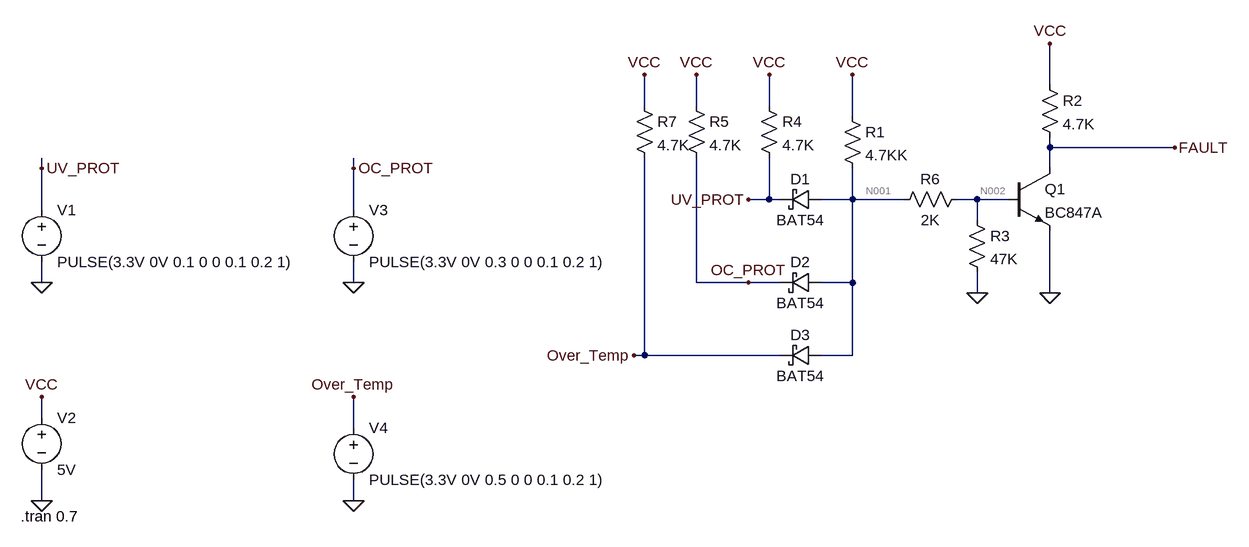
[diagram p0: schematic FaultOR.asc]
FaultOR.asc, the LTspice schematic file:
Version 4
SHEET 1 1984 864
WIRE 1504 -240 1504 -304
WIRE 880 -208 880 -256
WIRE 960 -208 960 -256
WIRE 1072 -208 1072 -256
WIRE 1200 -192 1200 -256
WIRE 1504 -144 1504 -160
WIRE 1696 -144 1504 -144
WIRE -48 -112 -48 -128
WIRE 432 -112 432 -128
WIRE 1504 -112 1504 -144
WIRE 1072 -64 1072 -128
WIRE 1072 -64 1040 -64
WIRE 1088 -64 1072 -64
WIRE 1200 -64 1200 -112
WIRE 1200 -64 1152 -64
WIRE 1280 -64 1200 -64
WIRE 1392 -64 1360 -64
WIRE 1440 -64 1392 -64
WIRE -48 -48 -48 -112
WIRE 432 -48 432 -112
WIRE 1392 -32 1392 -64
WIRE -48 64 -48 32
WIRE 432 64 432 32
WIRE 960 64 960 -128
WIRE 1040 64 960 64
WIRE 1088 64 1040 64
WIRE 1200 64 1200 -64
WIRE 1200 64 1152 64
WIRE 1392 80 1392 48
WIRE 1504 80 1504 -16
WIRE 880 176 880 -128
WIRE 880 176 864 176
WIRE 1088 176 880 176
WIRE 1200 176 1200 64
WIRE 1200 176 1152 176
WIRE -48 272 -48 240
WIRE 432 288 432 240
WIRE -48 400 -48 352
WIRE 432 400 432 368
FLAG -48 240 VCC
FLAG -48 400 0
FLAG -48 64 0
FLAG -48 -112 UV_PROT
FLAG 432 64 0
FLAG 432 -112 OC_PROT
FLAG 1040 -64 UV_PROT
FLAG 1040 64 OC_PROT
FLAG 1200 -256 VCC
FLAG 1504 80 0
FLAG 1504 -304 VCC
FLAG 1072 -256 VCC
FLAG 960 -256 VCC
FLAG 1392 80 0
FLAG 880 -256 VCC
FLAG 1696 -144 FAULT
FLAG 864 176 Over_Temp
FLAG 432 400 0
FLAG 432 240 Over_Temp
SYMBOL voltage -48 256 R0
WINDOW 123 0 0 Left 0
WINDOW 39 0 0 Left 0
SYMATTR InstName V2
SYMATTR Value 5V
SYMBOL voltage -48 -64 R0
WINDOW 123 0 0 Left 0
WINDOW 39 0 0 Left 0
SYMATTR InstName V1
SYMATTR Value PULSE(3.3V 0V 0.1 0 0 0.1 0.2 1)
SYMBOL voltage 432 -64 R0
WINDOW 123 0 0 Left 0
WINDOW 39 0 0 Left 0
SYMATTR InstName V3
SYMATTR Value PULSE(3.3V 0V 0.3 0 0 0.1 0.2 1)
SYMBOL schottky 1152 -80 R90
WINDOW 0 0 32 VBottom 2
WINDOW 3 32 32 VTop 2
SYMATTR InstName D1
SYMATTR Value BAT54
SYMATTR Description Diode
SYMATTR Type diode
SYMBOL schottky 1152 48 R90
WINDOW 0 0 32 VBottom 2
WINDOW 3 32 32 VTop 2
SYMATTR InstName D2
SYMATTR Value BAT54
SYMATTR Description Diode
SYMATTR Type diode
SYMBOL res 1184 -208 R0
SYMATTR InstName R1
SYMATTR Value 4.7KK
SYMBOL npn 1440 -112 R0
SYMATTR InstName Q1
SYMATTR Value BC847A
SYMBOL res 1488 -256 R0
SYMATTR InstName R2
SYMATTR Value 4.7K
SYMBOL res 1056 -224 R0
SYMATTR InstName R4
SYMATTR Value 4.7K
SYMBOL res 944 -224 R0
SYMATTR InstName R5
SYMATTR Value 4.7K
SYMBOL res 1376 -48 R0
SYMATTR InstName R3
SYMATTR Value 47K
SYMBOL res 1376 -80 R90
WINDOW 0 0 56 VBottom 2
WINDOW 3 32 56 VTop 2
SYMATTR InstName R6
SYMATTR Value 2K
SYMBOL schottky 1152 160 R90
WINDOW 0 0 32 VBottom 2
WINDOW 3 32 32 VTop 2
SYMATTR InstName D3
SYMATTR Value BAT54
SYMATTR Description Diode
SYMATTR Type diode
SYMBOL res 864 -224 R0
SYMATTR InstName R7
SYMATTR Value 4.7K
SYMBOL voltage 432 272 R0
WINDOW 123 0 0 Left 0
WINDOW 39 0 0 Left 0
SYMATTR InstName V4
SYMATTR Value PULSE(3.3V 0V 0.5 0 0 0.1 0.2 1)
TEXT -80 424 Left 2 !.tran 0.7

The netlist it stands for:
* FaultOR.asc
V2 VCC 0 5V
V1 UV_PROT 0 PULSE(3.3V 0V 0.1 0 0 0.1 0.2 1)
V3 OC_PROT 0 PULSE(3.3V 0V 0.3 0 0 0.1 0.2 1)
D1 N001 UV_PROT BAT54
D2 N001 OC_PROT BAT54
R1 VCC N001 4.7KK
Q1 FAULT N002 0 0 BC847A
R2 VCC FAULT 4.7K
R4 VCC UV_PROT 4.7K
R5 VCC OC_PROT 4.7K
R3 N002 0 47K
R6 N002 N001 2K
D3 N001 Over_Temp BAT54
R7 VCC Over_Temp 4.7K
V4 Over_Temp 0 PULSE(3.3V 0V 0.5 0 0 0.1 0.2 1)
.model D D
.lib standard.dio
.model NPN NPN
.model PNP PNP
.lib standard.bjt
.tran 0.7
.backanno
.end

* Results of the author's LTspice run, read from the files saved beside the schematic
* Operating Point, zero values left out:
*   V(vcc) = 5 V
*   V(uv_prot) = 3.3 V
*   V(oc_prot) = 3.3 V
*   V(n001) = 1.981 V
*   V(fault) = 13.06 mV
*   V(n002) = 696 mV
*   V(over_temp) = 3.3 V
*   Ic(Q1) = 1.061 mA
*   Ib(Q1) = 627.8 µA
*   Ie(Q1) = -1.689 mA
*   I(D1) = -100 nA
*   I(D2) = -100 nA
*   I(D3) = -100 nA
*   I(R1) = 642.3 µA
*   I(R2) = 1.061 mA
*   I(R4) = 361.7 µA
*   I(R5) = 361.7 µA
*   I(R3) = 14.81 µA
*   I(R6) = -642.6 µA
*   I(R7) = 361.7 µA
*   I(V2) = -2.788 mA
*   I(V1) = 361.6 µA
*   I(V3) = 361.6 µA
*   I(V4) = 361.6 µA
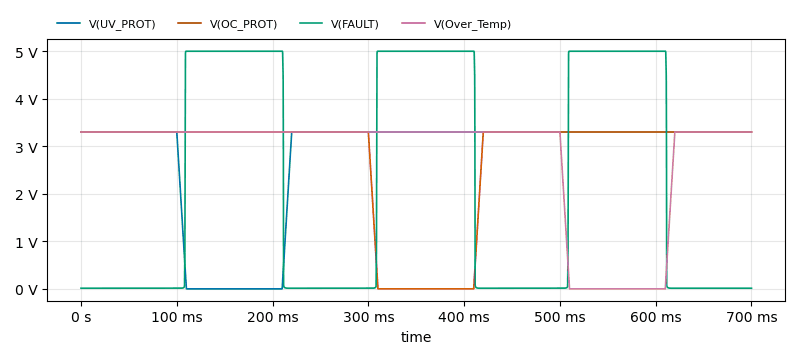
[diagram p1: Transient Analysis of FaultOR.asc, plotted from the saved traces]
* Transient Analysis, 1 run:
*   V(UV_PROT): min 0 V, max 3.3 V, average 2.781 V, rms 3.021 V, last 3.3 V
*   V(OC_PROT): min 0 V, max 3.3 V, average 2.781 V, rms 3.021 V, last 3.3 V
*   V(FAULT): min 13.06 mV, max 5 V, average 2.206 V, rms 3.312 V, last 13.06 mV
*   V(Over_Temp): min 0 V, max 3.3 V, average 2.781 V, rms 3.021 V, last 3.3 V